# Altium schematic sheet IO Expansion.SchDoc: IO Expansion
size B; DrawnBy: Jasper Yun; SheetNumber: 6; SheetTotal: 13; Competition: SAC 2021; Subteam: Avionics; University: McGill University; Location: Montreal, Quebec; Project: Avionics Project Name; MRT: McGill Rocket Team
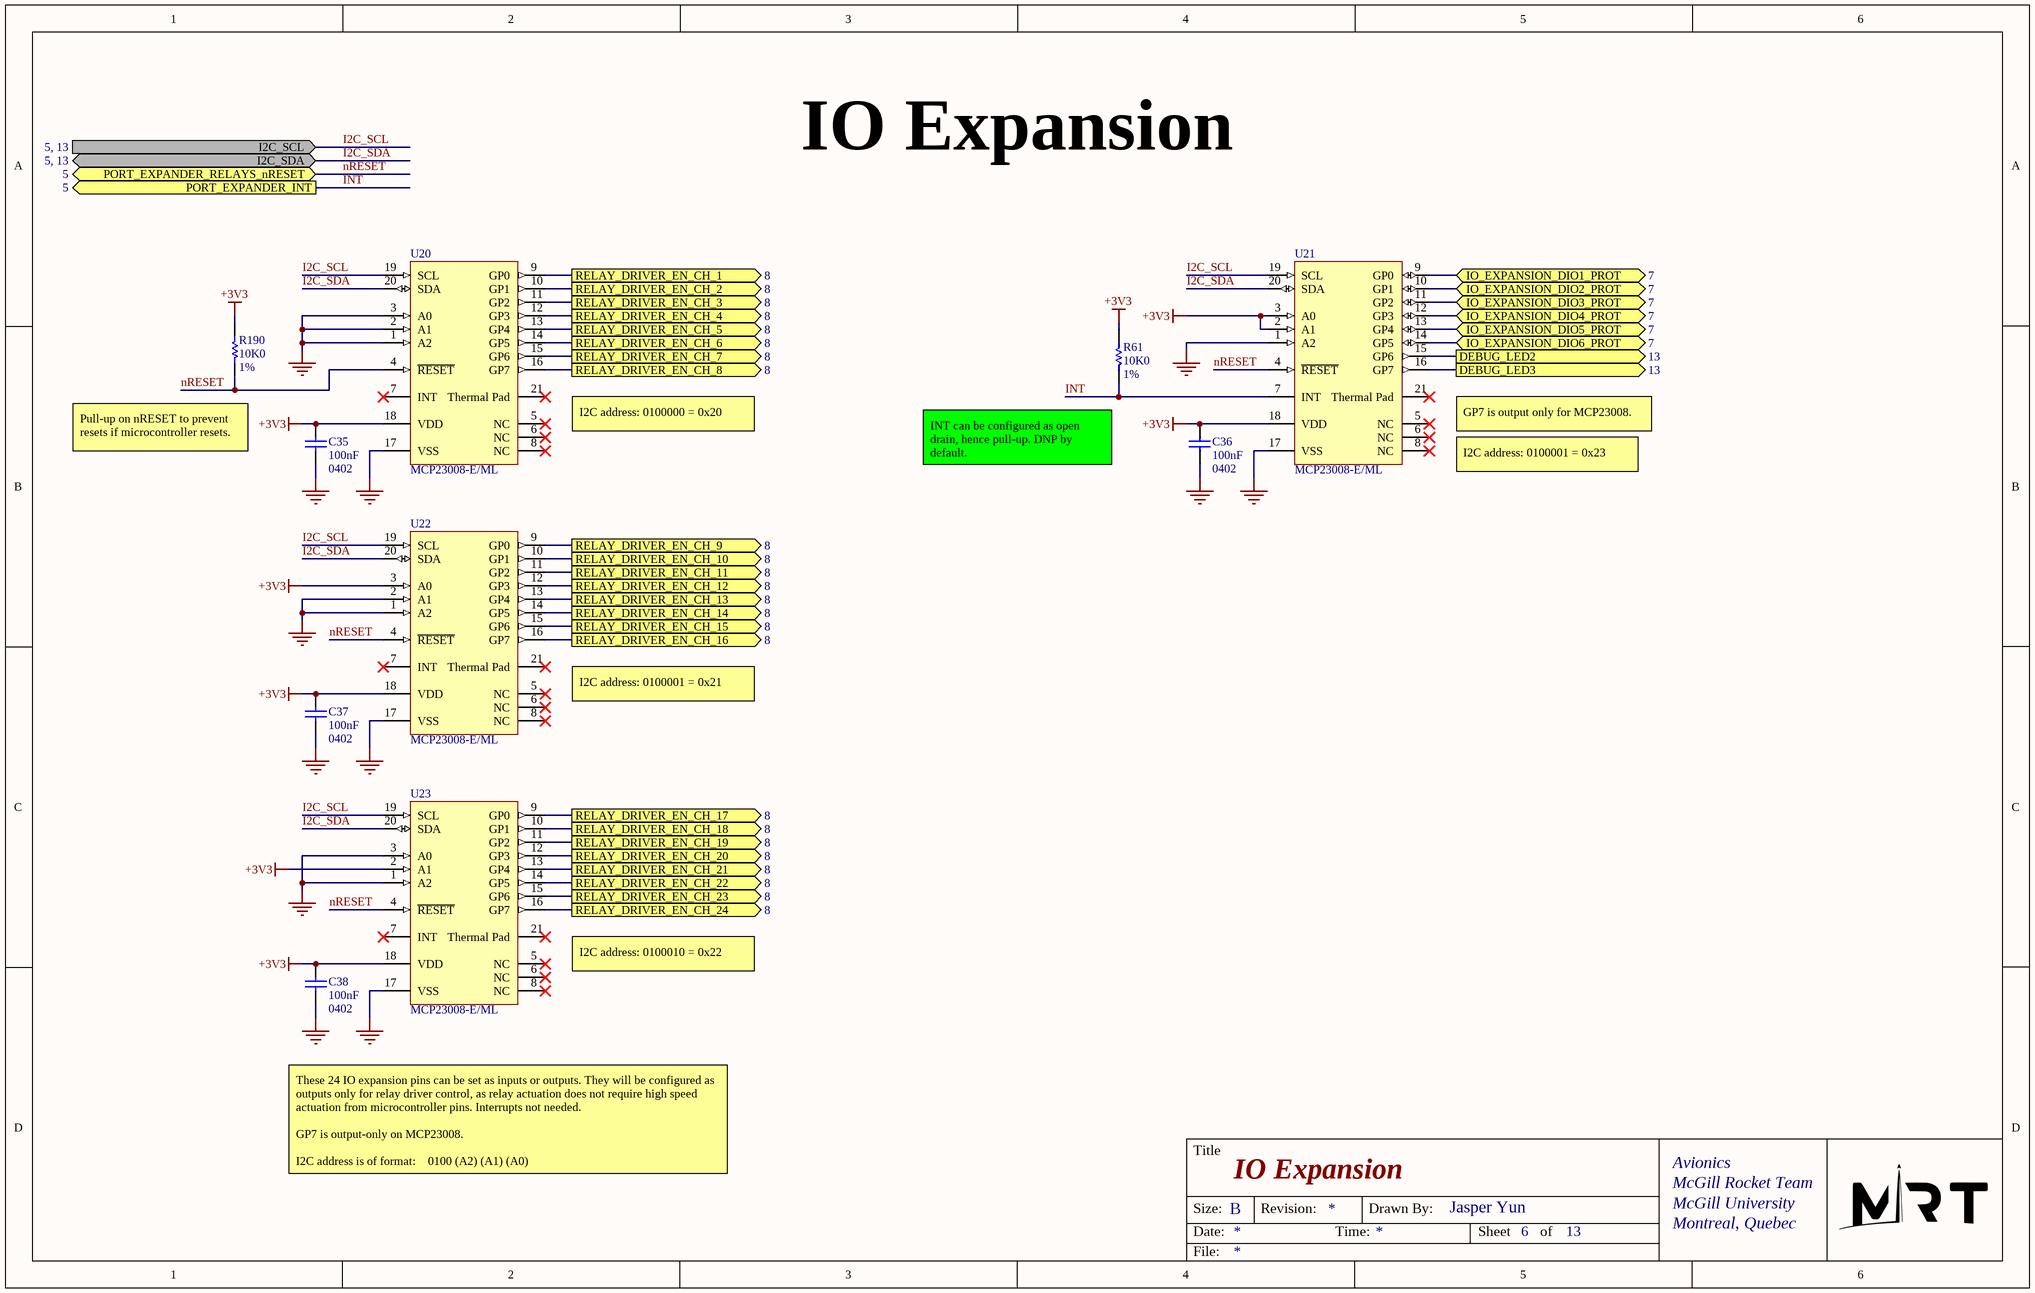
[diagram p0: IO Expansion.SchDoc]

## Parts
C35  100nF  value 0402  [0402 CAP]
C36  100nF  value 0402  [0402 CAP]
C37  100nF  value 0402  [0402 CAP]
C38  100nF  value 0402  [0402 CAP]
R61  10K0  value 1%  [0402 RES]
R190  10K0  value 1%  [0402 RES]
U20  MCP23008-E/ML  [QFN-ML20_M]
U21  MCP23008-E/ML  [QFN-ML20_M]
U22  MCP23008-E/ML  [QFN-ML20_M]
U23  MCP23008-E/ML  [QFN-ML20_M]

## Ports
DEBUG_LED2 (out, see 13), DEBUG_LED3 (out, see 13), I2C_SCL (in, see 5, 13), I2C_SDA (bidir, see 5, 13), IO_EXPANSION_DIO1_PROT (bidir, see 7), IO_EXPANSION_DIO2_PROT (bidir, see 7), IO_EXPANSION_DIO3_PROT (bidir, see 7), IO_EXPANSION_DIO4_PROT (bidir, see 7), IO_EXPANSION_DIO5_PROT (bidir, see 7), IO_EXPANSION_DIO6_PROT (bidir, see 7), PORT_EXPANDER_INT (out, see 5), PORT_EXPANDER_RELAYS_nRESET (bidir, see 5), RELAY_DRIVER_EN_CH_1 (out, see 8), RELAY_DRIVER_EN_CH_2 (out, see 8), RELAY_DRIVER_EN_CH_3 (out, see 8), RELAY_DRIVER_EN_CH_4 (out, see 8), RELAY_DRIVER_EN_CH_5 (out, see 8), RELAY_DRIVER_EN_CH_6 (out, see 8), RELAY_DRIVER_EN_CH_7 (out, see 8), RELAY_DRIVER_EN_CH_8 (out, see 8), RELAY_DRIVER_EN_CH_9 (out, see 8), RELAY_DRIVER_EN_CH_10 (out, see 8), RELAY_DRIVER_EN_CH_11 (out, see 8), RELAY_DRIVER_EN_CH_12 (out, see 8), RELAY_DRIVER_EN_CH_13 (out, see 8), RELAY_DRIVER_EN_CH_14 (out, see 8), RELAY_DRIVER_EN_CH_15 (out, see 8), RELAY_DRIVER_EN_CH_16 (out, see 8), RELAY_DRIVER_EN_CH_17 (out, see 8), RELAY_DRIVER_EN_CH_18 (out, see 8), RELAY_DRIVER_EN_CH_19 (out, see 8), RELAY_DRIVER_EN_CH_20 (out, see 8), RELAY_DRIVER_EN_CH_21 (out, see 8), RELAY_DRIVER_EN_CH_22 (out, see 8), RELAY_DRIVER_EN_CH_23 (out, see 8), RELAY_DRIVER_EN_CH_24 (out, see 8)

## Nets
+3V3: C35.2 C36.2 C37.2 C38.2 R61.1 R190.1 U20.18(VDD) U21.2(A1) U21.3(A0) U21.18(VDD) U22.3(A0) U22.18(VDD) U23.2(A1) U23.18(VDD)
GND: C35.1 C36.1 C37.1 C38.1 U20.1(A2) U20.2(A1) U20.3(A0) U20.17(VSS) U21.1(A2) U21.17(VSS) U22.1(A2) U22.2(A1) U22.17(VSS) U23.1(A2) U23.3(A0) U23.17(VSS)
DEBUG_LED2: U21.15(GP6) ; port DEBUG_LED2
DEBUG_LED3: U21.16(GP7) ; port DEBUG_LED3
I2C_SCL: U20.19(SCL) U21.19(SCL) U22.19(SCL) U23.19(SCL) ; port I2C_SCL
I2C_SDA: U20.20(SDA) U21.20(SDA) U22.20(SDA) U23.20(SDA) ; port I2C_SDA
INT: R61.2 U21.7(INT) ; port PORT_EXPANDER_INT
IO_EXPANSION_DIO1_PROT: U21.9(GP0) ; port IO_EXPANSION_DIO1_PROT
IO_EXPANSION_DIO2_PROT: U21.10(GP1) ; port IO_EXPANSION_DIO2_PROT
IO_EXPANSION_DIO3_PROT: U21.11(GP2) ; port IO_EXPANSION_DIO3_PROT
IO_EXPANSION_DIO4_PROT: U21.12(GP3) ; port IO_EXPANSION_DIO4_PROT
IO_EXPANSION_DIO5_PROT: U21.13(GP4) ; port IO_EXPANSION_DIO5_PROT
IO_EXPANSION_DIO6_PROT: U21.14(GP5) ; port IO_EXPANSION_DIO6_PROT
nRESET: R190.2 U20.4(~{RESET}) U21.4(~{RESET}) U22.4(~{RESET}) U23.4(~{RESET}) ; port PORT_EXPANDER_RELAYS_nRESET
RELAY_DRIVER_EN_CH_1: U20.9(GP0) ; port RELAY_DRIVER_EN_CH_1
RELAY_DRIVER_EN_CH_2: U20.10(GP1) ; port RELAY_DRIVER_EN_CH_2
RELAY_DRIVER_EN_CH_3: U20.11(GP2) ; port RELAY_DRIVER_EN_CH_3
RELAY_DRIVER_EN_CH_4: U20.12(GP3) ; port RELAY_DRIVER_EN_CH_4
RELAY_DRIVER_EN_CH_5: U20.13(GP4) ; port RELAY_DRIVER_EN_CH_5
RELAY_DRIVER_EN_CH_6: U20.14(GP5) ; port RELAY_DRIVER_EN_CH_6
RELAY_DRIVER_EN_CH_7: U20.15(GP6) ; port RELAY_DRIVER_EN_CH_7
RELAY_DRIVER_EN_CH_8: U20.16(GP7) ; port RELAY_DRIVER_EN_CH_8
RELAY_DRIVER_EN_CH_9: U22.9(GP0) ; port RELAY_DRIVER_EN_CH_9
RELAY_DRIVER_EN_CH_10: U22.10(GP1) ; port RELAY_DRIVER_EN_CH_10
RELAY_DRIVER_EN_CH_11: U22.11(GP2) ; port RELAY_DRIVER_EN_CH_11
RELAY_DRIVER_EN_CH_12: U22.12(GP3) ; port RELAY_DRIVER_EN_CH_12
RELAY_DRIVER_EN_CH_13: U22.13(GP4) ; port RELAY_DRIVER_EN_CH_13
RELAY_DRIVER_EN_CH_14: U22.14(GP5) ; port RELAY_DRIVER_EN_CH_14
RELAY_DRIVER_EN_CH_15: U22.15(GP6) ; port RELAY_DRIVER_EN_CH_15
RELAY_DRIVER_EN_CH_16: U22.16(GP7) ; port RELAY_DRIVER_EN_CH_16
RELAY_DRIVER_EN_CH_17: U23.9(GP0) ; port RELAY_DRIVER_EN_CH_17
RELAY_DRIVER_EN_CH_18: U23.10(GP1) ; port RELAY_DRIVER_EN_CH_18
RELAY_DRIVER_EN_CH_19: U23.11(GP2) ; port RELAY_DRIVER_EN_CH_19
RELAY_DRIVER_EN_CH_20: U23.12(GP3) ; port RELAY_DRIVER_EN_CH_20
RELAY_DRIVER_EN_CH_21: U23.13(GP4) ; port RELAY_DRIVER_EN_CH_21
RELAY_DRIVER_EN_CH_22: U23.14(GP5) ; port RELAY_DRIVER_EN_CH_22
RELAY_DRIVER_EN_CH_23: U23.15(GP6) ; port RELAY_DRIVER_EN_CH_23
RELAY_DRIVER_EN_CH_24: U23.16(GP7) ; port RELAY_DRIVER_EN_CH_24

Not connected (* = marked no-connect by the designer): U20 5(NC)* 6(NC)* 7(INT)* 8(NC)* 21(Thermal_Pad)*; U21 5(NC)* 6(NC)* 8(NC)* 21(Thermal_Pad)*; U22 5(NC)* 6(NC)* 7(INT)* 8(NC)* 21(Thermal_Pad)*; U23 5(NC)* 6(NC)* 7(INT)* 8(NC)* 21(Thermal_Pad)*

## Notes on the sheet
- I2C address: 0100000 = 0x20
- GP7 is output only for MCP23008.
- (near R190) Pull-up on nRESET to prevent resets if microcontroller resets.
- (near R61) INT can be configured as open drain, hence pull-up. DNP by default.
- I2C address: 0100001 = 0x23
- I2C address: 0100001 = 0x21
- I2C address: 0100010 = 0x22
- These 24 IO expansion pins can be set as inputs or outputs. They will be configured as outputs only for relay driver control, as relay actuation does not require high speed actuation from microcontroller pins. Interrupts not needed.
  GP7 is output-only on MCP23008.
  I2C address is of format:    0100 (A2) (A1) (A0)
- Title
- Size:
- Date:
- B
- Revision:
- Time:
- Drawn By:
- Sheet
- of
- File:

## Library data of the parts
C35-C38 = Cap: Capacitor; Published: 8-Jun-2000; LatestRevisionDate: 17-Jul-2002; LatestRevisionNote: Re-released for DXP Platform.; PackageReference: RAD-0.3; Publisher: Altium Limited; PackageDescription: Radial Cap, Thru-Hole; 2 Leads; 0.3 in Pin Spacing
R61 R190 = Res1: Resistor; Published: 8-Jun-2000; LatestRevisionDate: 17-Jul-2002; LatestRevisionNote: Re-released for DXP Platform.; PackageReference: AXIAL-0.3; Publisher: Altium Limited; PackageDescription: Axial Device, Thru-Hole; 2 Leads; 0.3 in Pin Spacing
U20-U23 = CMP-0186-00018-2: 8-Bit I/O Expander with Serial Interface, 20-Pin QFN, Extended Temperature; ComponentLink2URL: http://ww1.microchip.com/downloads/en/DeviceDoc/21919e.pdf; ComponentLink1Description: Manufacturer URL; ComponentLink3Description: Package Specification; ComponentLink1URL: http://www.microchip.com/; RevisionNote: URLs added.; PackageReference: QFN-ML20; ComponentLink2Description: Datasheet; PackageDescription: 20-Lead Plastic Quad Flat, No Lead Package (ML) - 4x4x0.9 mm Body [QFN]; ComponentLink3URL: http://www.microchip.com/stellent/groups/techpub_sg/documents/packagingspec/en012702.pdf; DatasheetVersion: revE, Aug-2007; PackageVersion: revBB, Aug-2009